# Altium project Rectifer.PrjPcb
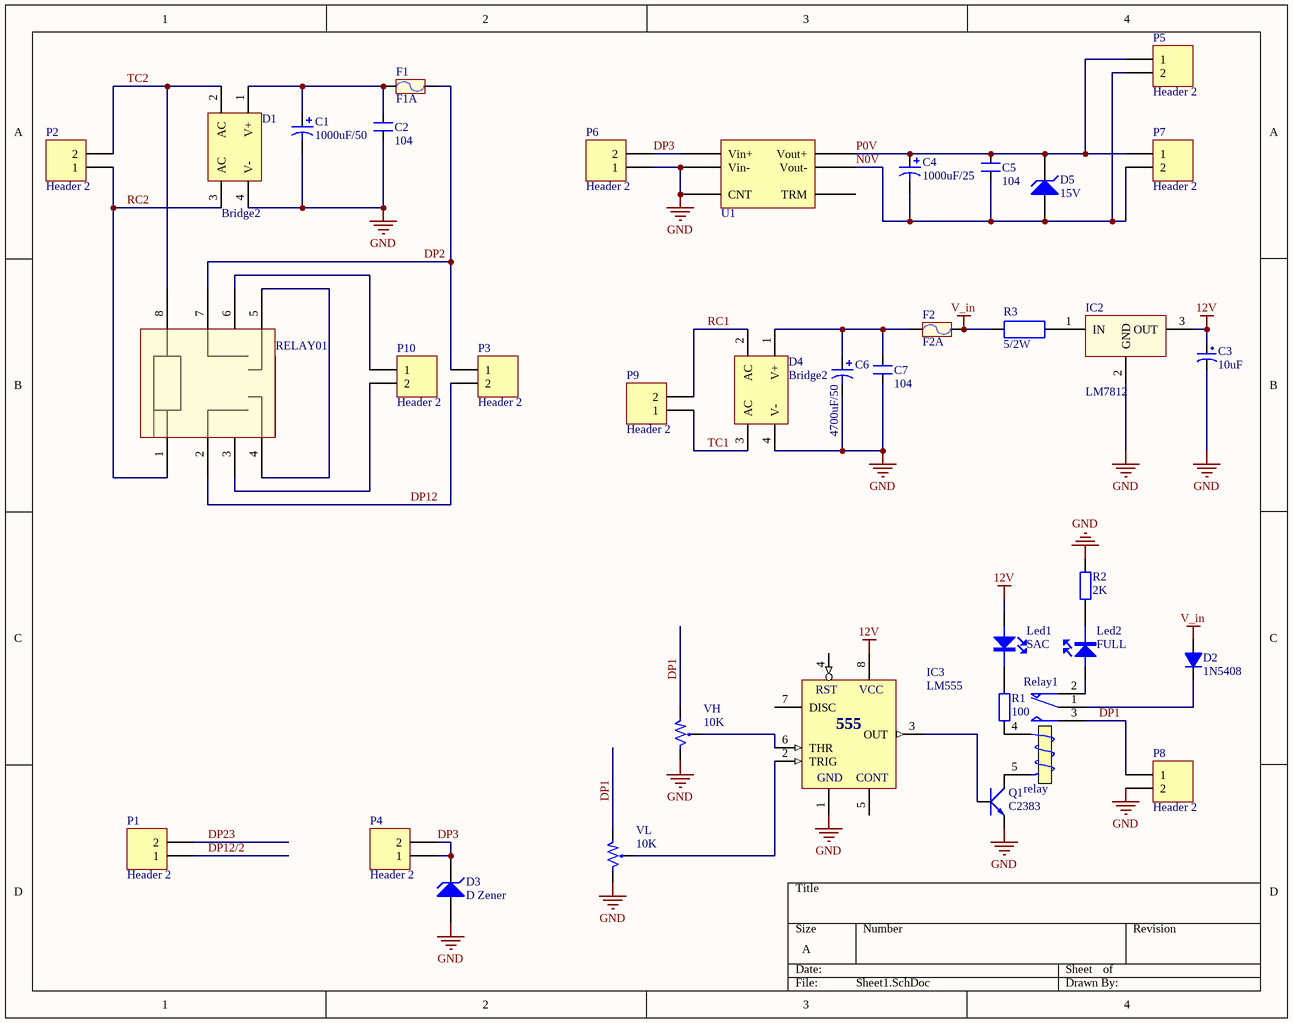
[diagram p0: Sheet1.SchDoc]
1 sheet, 37 parts. Net scope: global (net labels, ports and power ports of the same name join across sheets).
Board file: Rectifer.PcbDoc

## Sheet Sheet1.SchDoc
size A

### Parts
C1  1000uF/50  [RB7.6-15]
C2  104  [CN3]
C3  10uF  [CP1/2]
C4  1000uF/25  [RB7.6-15]
C5  104  [CN3]
C6  4700uF/50  [RB7.6-15]
C7  104  [CN3]
D1  Bridge2  [KBU1010]
D2  1N5408  [D5A]
D3  D Zener  [DZ1A]
D4  Bridge2  [KBU1010]
D5  15V  [DZ1A]
F1  F1A  [Fuse]
F2  F2A  [Fuse]
IC2  LM7812  [QTO-220]
IC3  LM555  [DIP8/W0.3]
Led1  SAC  [Led don]
Led2  FULL  [Led don]
P1  Header 2  [CON2 5.08]
P2  Header 2  [CON2 5.08]
P3  Header 2  [CON2 5.08]
P4  Header 2  [CON2 5.08]
P5  Header 2  [CON2 5.08]
P6  Header 2  [CON2 5.08]
P7  Header 2  [CON2 5.08]
P8  Header 2  [CON2 5.08]
P9  Header 2  [CON2 5.08]
P10  Header 2  [CON2 5.08]
Q1  C2383  [QTO-92]
R1  100  [R1/4W]
R2  2K  [R1/4W]
R3  5/2W  [R2W]
Relay1  relay  [Relay1]
RELAY01  DPDT 8 Pin Terminals Relay  [DPDT 8 Pin Terminals Relay]  (value not drawn)
U1  PP15  [PP15]  (value not drawn)
VH  10K  [VR1]
VL  10K  [VR1]

### Nets
12V: C3.1 IC2.3(OUT) IC3.8(VCC) Led1.1(A)
GND: C1.2 C2.1 C3.2 C6.2 C7.1 D1.4(V-) D3.1(A) D4.4(V-) IC2.2(GND) IC3.1(GND) P6.1 P8.2 Q1.1(E) R2.1 U1.2(Vin-) U1.3(CNT) VH.3 VL.3
V_in: D2.1(A) F2.2 R3.1
DP1: P8.1 Relay1.3(NO) VH.1 VL.1
DP2: F1.2 P3.1 RELAY01.7
DP3: D3.2(K) P4.1 P4.2 P6.2 U1.1(Vin+)
DP12: P3.2 RELAY01.2
DP12/2: P1.1
DP23: P1.2
N0V: C4.2 C5.1 D5.1(A) P5.2 P7.2 U1.5(Vout-)
P0V: C4.1 C5.2 D5.2(K) P5.1 P7.1 U1.6(Vout+)
RC1: D4.2(AC) P9.2
RC2: D1.3(AC) P2.1 RELAY01.1
TC1: D4.3(AC) P9.1
TC2: D1.2(AC) P2.2 RELAY01.8
NetC1_1: C1.1 C2.2 D1.1(V+) F1.1
NetC6_1: C6.1 C7.2 D4.1(V+) F2.1
NetD2_2: D2.2(K) Relay1.1(COM)
NetIC2_1: IC2.1(IN) R3.2
NetIC3_2: IC3.2(TRIG) VL.2
NetIC3_3: IC3.3(OUT) Q1.3(B)
NetIC3_6: IC3.6(THR) VH.2
NetLed1_2: Led1.2(K) R1.2
NetLed2_1: Led2.1(A) Relay1.2(NC)
NetLed2_2: Led2.2(K) R2.2
NetP10_1: P10.1 RELAY01.6
NetP10_2: P10.2 RELAY01.3
NetQ1_2: Q1.2(C) Relay1.5(T2)
NetR1_1: R1.1 Relay1.4(T1)
NetRELAY01_4: RELAY01.4 RELAY01.5

Not connected (* = marked no-connect by the designer): IC3 4(RST) 5(CONT) 7(DISC); U1 4(TRM)

### Notes on the sheet
- (in symbol LM555) 555

### Library data of the parts
C1 C4 C6 = Cap Pol1: Polarized Capacitor (Radial); Value: 100pF; Published: 8-Jun-2000; LatestRevisionDate: 17-Jul-2002; LatestRevisionNote: Re-released for DXP Platform.; PackageReference: RB7.6-15; Publisher: Altium Limited; PackageDescription: Polarized Capacitor (Radial); 2 Leads
C2 C5 C7 = CN3: Cap np W0.3; Value: 0,047uF; Copyright: VanDungEvn
C3 = CAP-HOA: Cap P  0,1uF < 22uF , 16 - 50V; Value: 10uF/50V; Description 1: 10 => 220uF/6,3V/10V - 10uF => 100uF/16V; Description 2: 0,1uF => 33uF/50V - 10uF => 22uF/63V; Description 3: 0,47uF => 10uF/100V
D1 D4 = Bridge2: Diode Bridge; Published: 24-Mar-1999; LatestRevisionDate: 17-Jul-2002; LatestRevisionNote: Re-released for DXP Platform.; PackageReference: D-46_6A; Publisher: Altium Limited; PackageDescription: Bridge Rectifier; 4 Terminals; Body 16.8 x 16.8 mm (typ); Pitch 10.67 mm
D2 = D5A: Diode 5A; Value: 1N5408
D3 D5 = D Zener: Zener Diode; Published: 8-Jun-2000; LatestRevisionDate: 17-Jul-2002; LatestRevisionNote: Re-released for DXP Platform.; PackageReference: DIODE-0.7; Publisher: Altium Limited; PackageDescription: Diode, Thru-Hole; 2 Leads; 0.7 in Pin Spacing
F1 F2 = Fuse: Designed by: VanDungEvn; Value: Fuse
IC2 = LM78xx: On ap +, from + 5 to + 24VDC; Value: LM7805
IC3 = LM555: Timer; Value: LM555
Led1 Led2 = led don
P1-P10 = Header 2: Header, 2-Pin; LatestRevisionDate: 17-Jul-2002; LatestRevisionNote: Re-released for DXP Platform.; Publisher: Altium Limited
Q1 = NPN_ECB: P 600mW, ECB; Value: C1815
R1 R2 = R: Resistor 1/4W; Value: R1/4W - 1K
R3 = R2W: Resistor 2W; Value: R2W - 47
Relay1 = Relay: SPDT Relay; Published: 8-Jun-2000; LatestRevisionDate: 17-Jul-2002; LatestRevisionNote: Re-released for DXP Platform.; PackageReference: MODULE5B; Publisher: Altium Limited
VH VL = VR1: Var Resistor; Value: VR 10K